# EasyEDA schematic SCH_ECE198-03.json
TITLE: Automatic-Garden; REV: 0.3; Date: 2022-10-26; Sheet: 1/1; Drawn By: Damir Gazizullin; Company: University of Waterloo
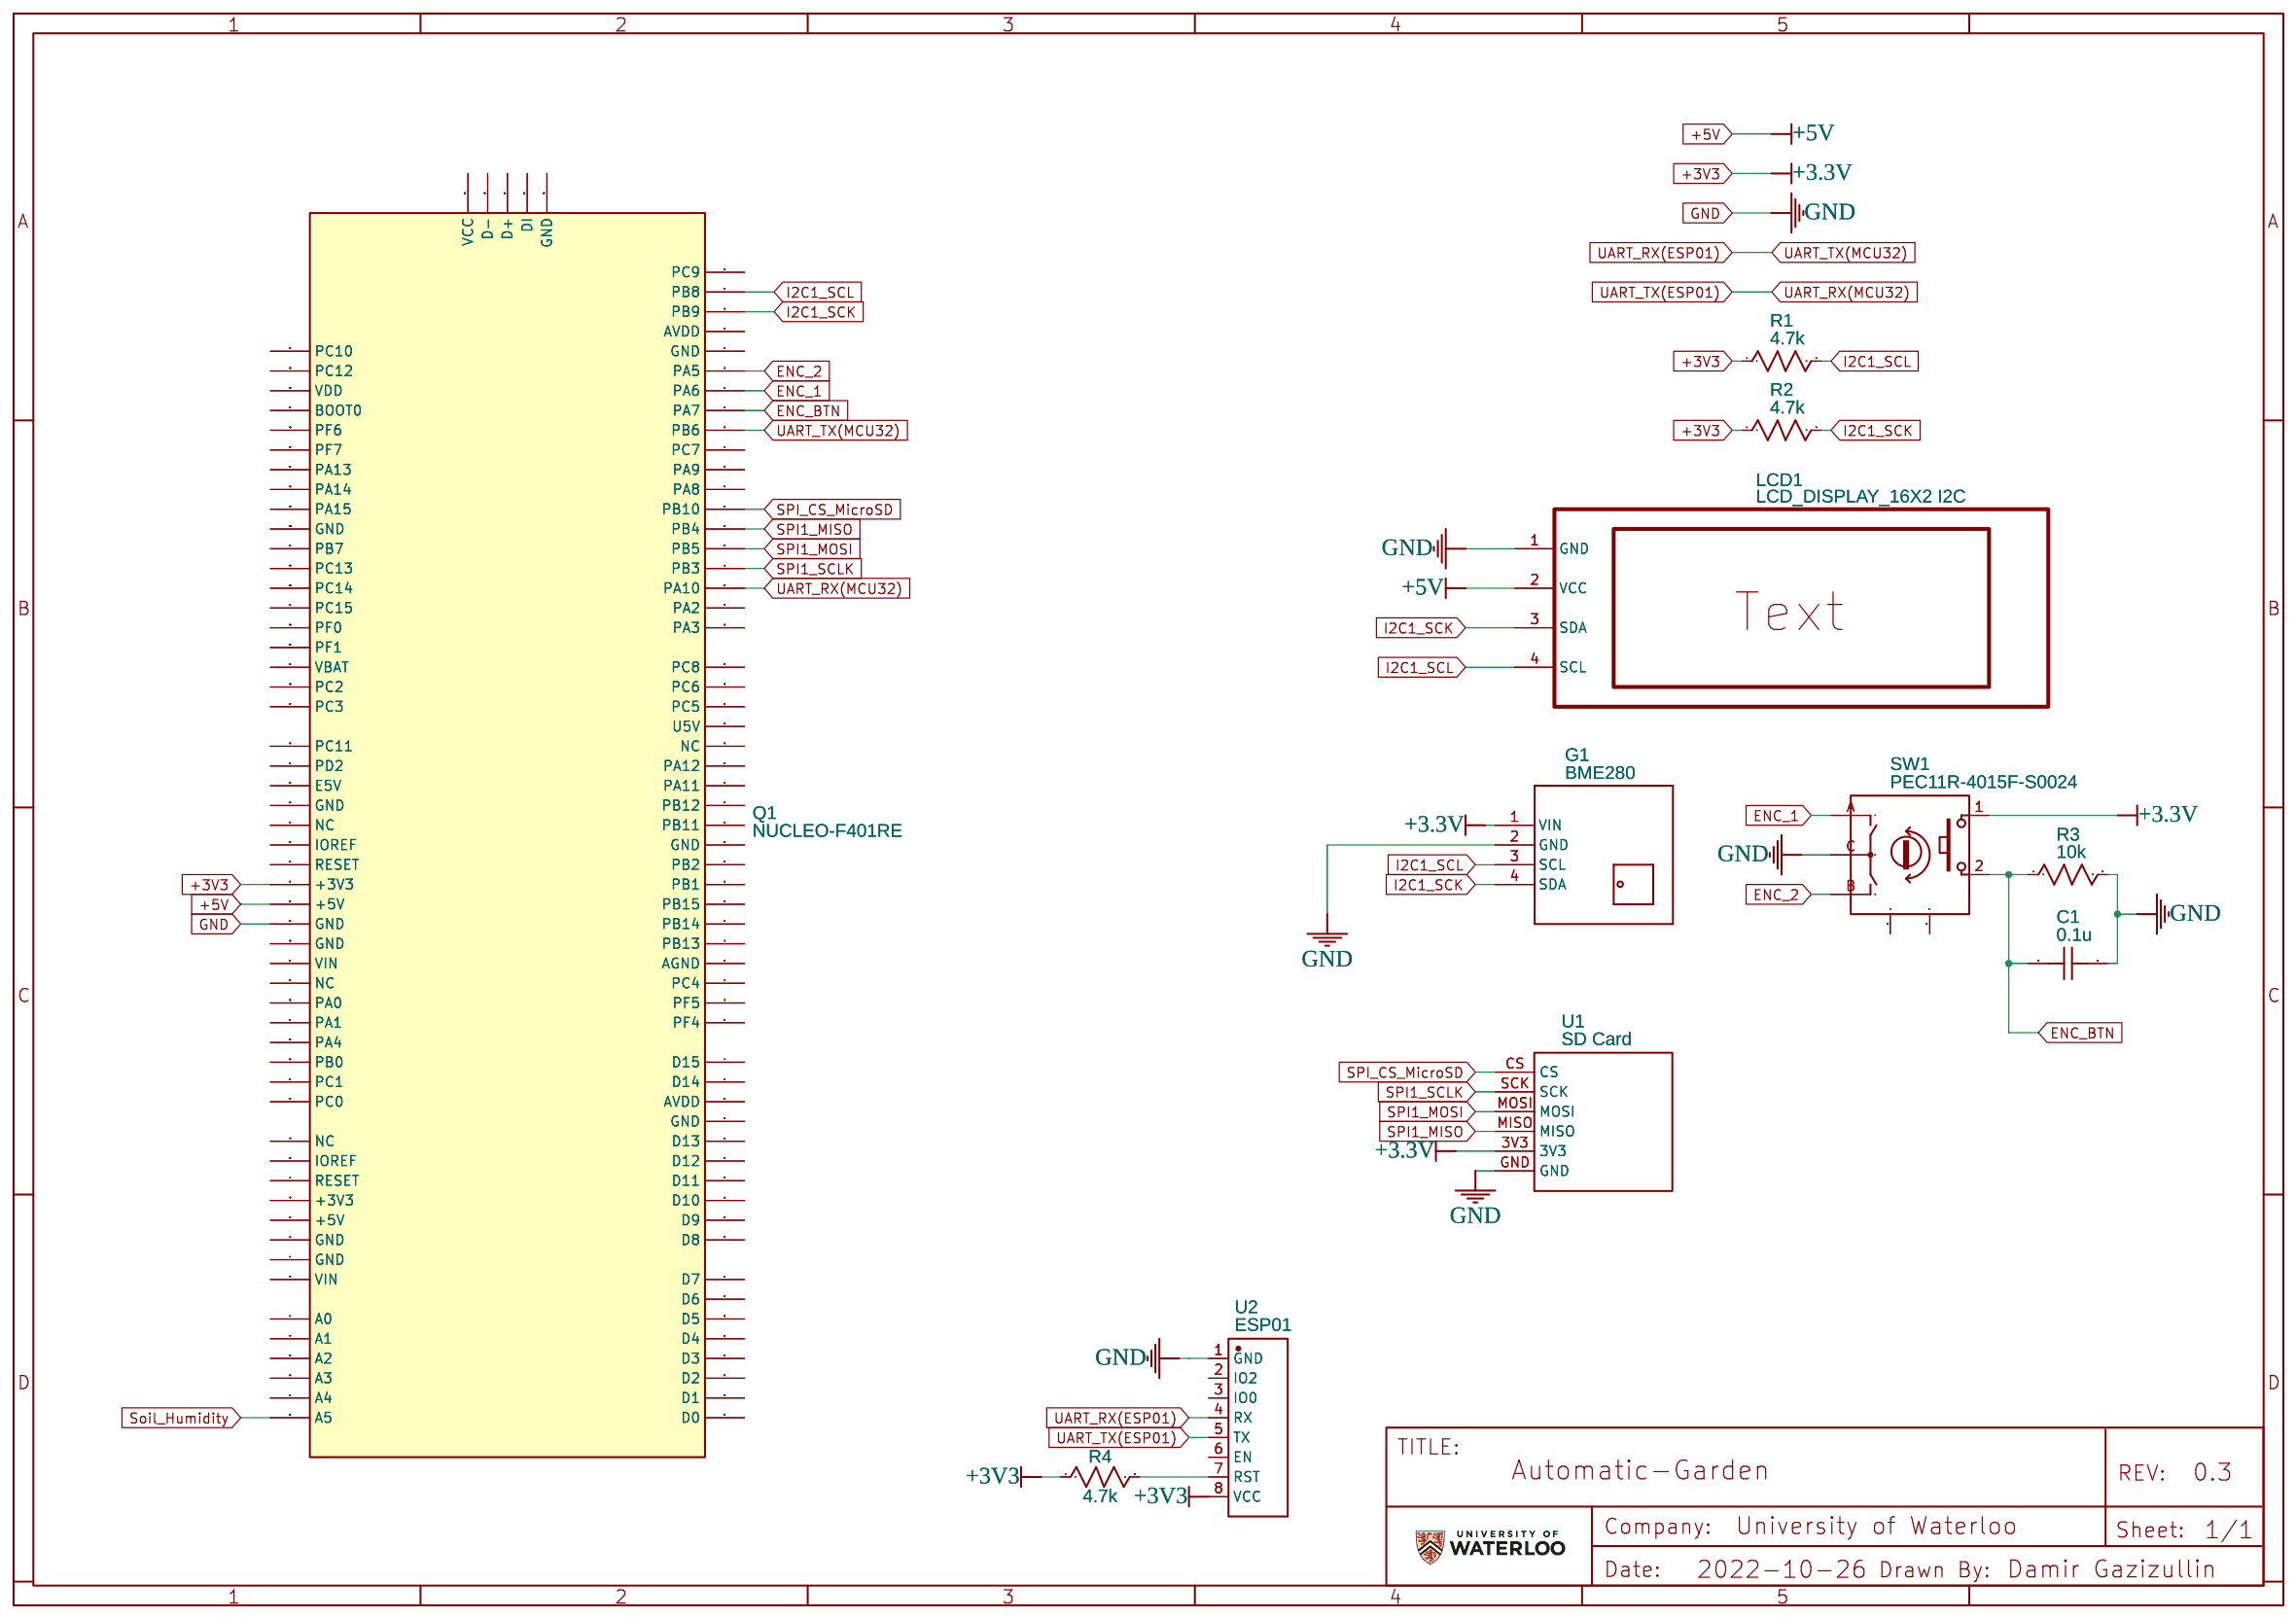
[diagram p0: schematic sheet]

## Parts
C1  0.1u  [C0603]
G1  BME280  [TEMP-HUM-PRES-BME280]
LCD1  LCD_DISPLAY_16X2 I2C  [LCD_2004_4-8BIT_IF LCD_2004_4-8BIT_IF V4 I2C]
Q1  NUCLEO-F401RE  [ARDUINOR3-NOTEXT-NOIOREF]
R1  4.7k  [R0603]
R2  4.7k  [R0603]
R3  10k  [R_AXIAL-0.5]
R4  4.7k  [R_AXIAL-0.5]
SW1  PEC11R-4015F-S0024  [SW-TH_PEC11R-4XXXF-SXXXX]
U1  SD Card  [SD CARD]
U2  ESP01  [ESP01]

## Library data of the parts
C1 = C_0603_US: Contributor: LCEDA_Lib
G1 = TEMP-HUM-PRES-BME280: Contributor: Azias
LCD1 = LCD_DISPLAY_16X2 I2C: sourceId: yDLFXRL3l; 15: A; Contributor: trailescu andreea
Q1 = NUCLEO-F401RE
R1 R2 = R_0603_US: Contributor: LCEDA_Lib
R3 R4 = R_AXIAL-0.5_US: Contributor: LCEDA_Lib
SW1 = PEC11R-4015F-S0024: Supplier: LCSC; Supplier Part: C143789; Manufacturer: BOURNS; Contributor: LCSC; JLCPCB Part Class: Extended Part
U1 = SD Card: Contributor: Дамир Газизуллин
U2 = ESP01: Contributor: luisfbarba

## Nets
+3.3V: G1.1(VIN) Q1.91(+3V3) R1.1 R2.1 R4.1 SW1.1 U1.3V3 U2.8(VCC)
+5V: LCD1.2(VCC) Q1.90(+5V)
GND: C1.2 G1.2(GND) LCD1.1(GND) Q1.89(GND) R3.2 SW1.C U1.GND U2.1(GND)
ENC_1: Q1.14(PA6) SW1.A
ENC_2: Q1.13(PA5) SW1.B
ENC_BTN: C1.1 Q1.15(PA7) R3.1 SW1.2
I2C1_SCK: G1.4(SDA) LCD1.3(SDA) Q1.10(PB9) R2.2
I2C1_SCL: G1.3(SCL) LCD1.4(SCL) Q1.9(PB8) R1.2
Soil_Humidity: Q1.66(A5)
SPI1_MISO: Q1.21(PB4) U1.MISO
SPI1_MOSI: Q1.22(PB5) U1.MOSI
SPI1_SCLK: Q1.23(PB3) U1.SCK
SPI_CS_MicroSD: Q1.20(PB10) U1.CS
UART_RX(ESP01): Q1.16(PB6) U2.4(RX)
UART_RX(MCU32): Q1.24(PA10) U2.5(TX)
Net-(R4-2): R4.2 U2.7(RST)

Not connected (* = marked no-connect by the designer): Q1 8(PC9) 11(AVDD) 12(GND) 17(PC7) 18(PA9) 19(PA8) 25(PA2) 26(PA3) 28(PC8) 29(PC6) 30(PC5) 31(U5V) 32(NC) 33(PA12) 34(PA11) 35(PB12) 36(PB11) 37(GND) 38(PB2) 39(PB1) 40(PB15) 41(PB14) 42(PB13) 43(AGND) 44(PC4) 45(PF5) 46(PF4) 47(D15) 48(D14) 49(AVDD) 50(GND) 51(D13) 52(D12) 53(D11) 54(D10) 55(D9) 56(D8) 58(D7) 59(D6) 60(D5) 61(D4) 62(D3) 63(D2) 64(D1) 65(D0) 67(A4) 68(A3) 69(A2) 70(A1) 71(A0) 72(VIN) 73(GND) 74(GND) 75(+5V) 76(+3V3) 77(RESET) 78(IOREF) 79(NC) 80(PC0) 81(PC1) 82(PB0) 83(PA4) 84(PA1) 85(PA0) 86(NC) 87(VIN) 88(GND) 92(RESET) 93(IOREF) 94(NC) 95(GND) 96(E5V) 97(PD2) 98(PC11) 99(PC3) 100(PC2) 101(VBAT) 102(PF1) 103(PF0) 104(PC15) 105(PC14) 106(PC13) 107(PB7) 108(GND) 109(PA15) 110(PA14) 111(PA13) 112(PF7) 113(PF6) 114(BOOT0) 115(VDD) 116(PC12) 117(PC10) 118(GND); SW1 MT1 MT2; U2 2(IO2) 3(IO0) 6(EN)
